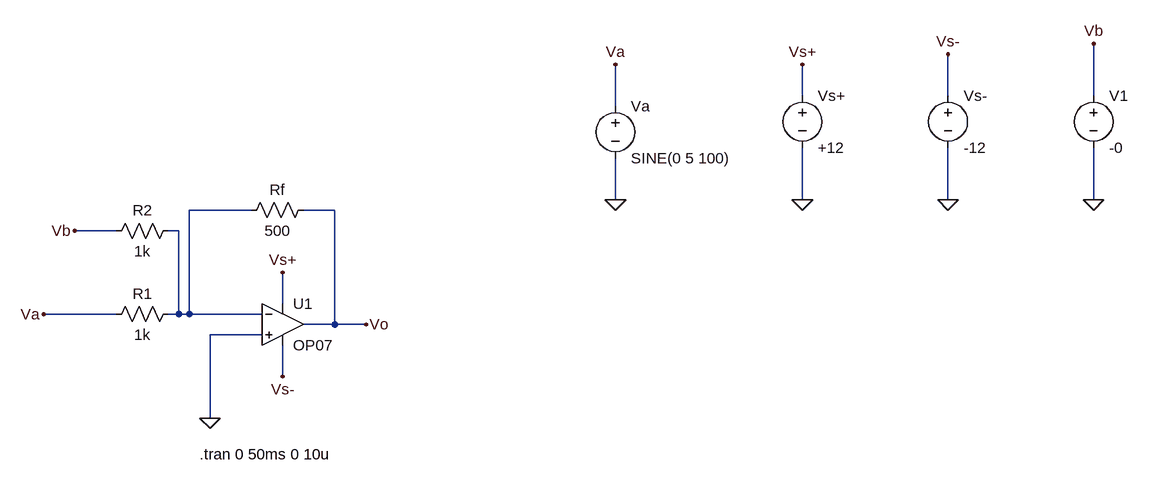
[diagram p0: schematic exp3.asc]
exp3.asc, the LTspice schematic file:
Version 4
SHEET 1 1720 680
WIRE 1184 -112 1184 -160
WIRE 1408 -112 1408 -176
WIRE 1632 -112 1632 -192
WIRE 896 -96 896 -160
WIRE 896 48 896 -16
WIRE 1184 48 1184 -32
WIRE 1408 48 1408 -32
WIRE 1632 48 1632 -32
WIRE 336 64 240 64
WIRE 464 64 416 64
WIRE 128 96 64 96
WIRE 224 96 208 96
WIRE 384 208 384 160
WIRE 128 224 16 224
WIRE 224 224 224 96
WIRE 224 224 208 224
WIRE 240 224 240 64
WIRE 240 224 224 224
WIRE 352 224 240 224
WIRE 464 240 464 64
WIRE 464 240 416 240
WIRE 512 240 464 240
WIRE 352 256 272 256
WIRE 384 320 384 272
WIRE 272 384 272 256
FLAG 896 48 0
FLAG 1184 48 0
FLAG 1408 48 0
FLAG 384 160 Vs+
FLAG 384 320 Vs-
FLAG 512 240 Vo
FLAG 896 -160 Va
FLAG 1184 -160 Vs+
FLAG 1408 -176 Vs-
FLAG 64 96 Vb
FLAG 1632 -192 Vb
FLAG 1632 48 0
FLAG 272 384 0
FLAG 16 224 Va
SYMBOL res 224 208 R90
WINDOW 0 0 56 VBottom 2
WINDOW 3 32 56 VTop 2
SYMATTR InstName R1
SYMATTR Value 1k
SYMBOL res 432 48 R90
WINDOW 0 0 56 VBottom 2
WINDOW 3 32 56 VTop 2
SYMATTR InstName Rf
SYMATTR Value 500
SYMBOL OpAmps\\OP07 384 176 R0
SYMATTR InstName U1
SYMBOL voltage 1184 -128 R0
SYMATTR InstName Vs+
SYMATTR Value +12
SYMBOL voltage 1408 -128 R0
SYMATTR InstName Vs-
SYMATTR Value -12
SYMBOL voltage 896 -112 R0
WINDOW 123 0 0 Left 0
WINDOW 39 0 0 Left 0
SYMATTR InstName Va
SYMATTR Value SINE(0 5 100)
SYMBOL res 224 80 R90
WINDOW 0 0 56 VBottom 2
WINDOW 3 32 56 VTop 2
SYMATTR InstName R2
SYMATTR Value 1k
SYMBOL voltage 1632 -128 R0
SYMATTR InstName V1
SYMATTR Value -0
TEXT 256 440 Left 2 !.tran 0 50ms 0 10u

The netlist it stands for:
* exp3.asc
R1 N001 Va 1k
Rf Vo N001 500
XU1 0 N001 Vs+ Vs- Vo LT1001  ; OP07, pins In+ In- V+ V- OUT
Vs+ Vs+ 0 +12
Vs- Vs- 0 -12
Va Va 0 SINE(0 5 100)
R2 N001 Vb 1k
V1 Vb 0 -0
.tran 0 50ms 0 10u
.lib LTC.lib
.backanno
.end